# Altium schematic sheet KeeWatch_Top_Level.SchDoc
size Letter
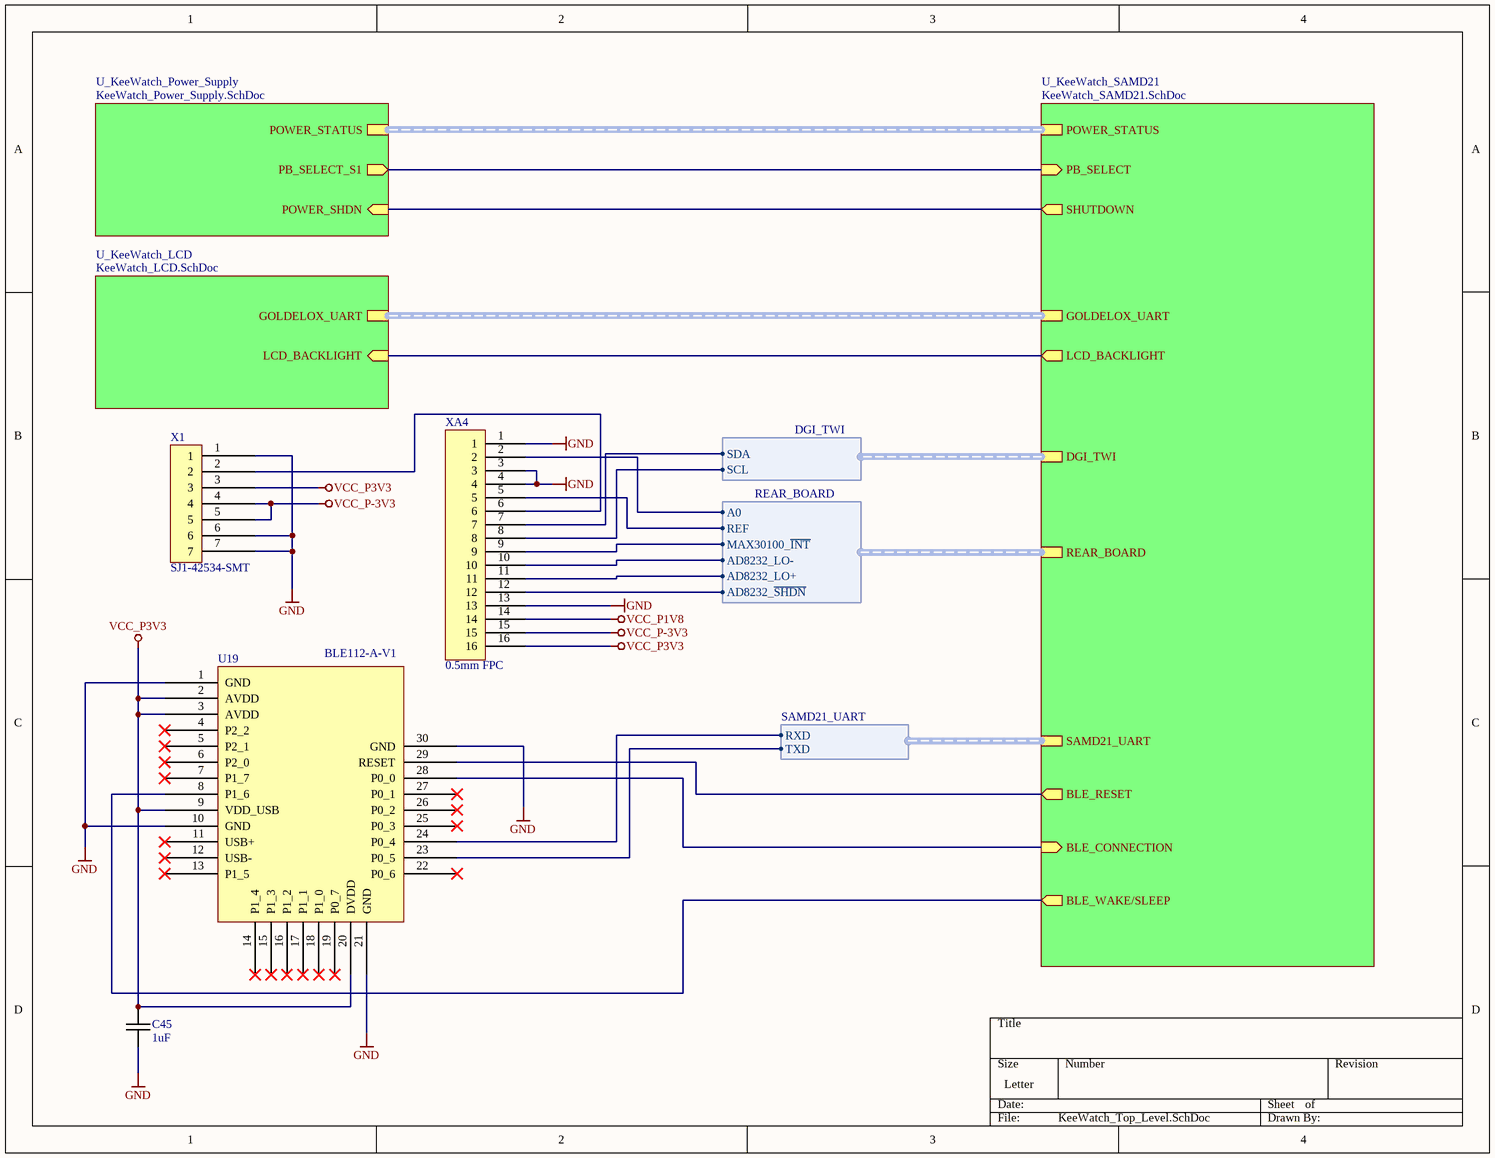
[diagram p0: KeeWatch_Top_Level.SchDoc]

## Parts
C45  1uF  [0603-Cap]
U19  BLE112-A-V1  [BLE112-A-V1]
X1  SJ1-42534-SMT  [AUDIO_JACK]
XA4  0.5mm FPC  [16-PIN CONNECTOR]

## Sub-sheets
U_KeeWatch_LCD = KeeWatch_LCD.SchDoc: LCD_BACKLIGHT (in), GOLDELOX_UART (harness GOLDELOX_UART)
U_KeeWatch_Power_Supply = KeeWatch_Power_Supply.SchDoc: POWER_SHDN (in), PB_SELECT_S1 (out), POWER_STATUS (harness POWER_STATUS)
U_KeeWatch_SAMD21 = KeeWatch_SAMD21.SchDoc: SAMD21_UART (harness SAMD21_UART), DGI_TWI (harness DGI_TWI), GOLDELOX_UART (harness GOLDELOX_UART), POWER_STATUS (harness POWER_STATUS), PB_SELECT (in), SHUTDOWN (out), LCD_BACKLIGHT (out), REAR_BOARD (harness REAR_BOARD), BLE_CONNECTION (in), BLE_RESET (out), BLE_WAKE/SLEEP (out)

## Harnesses
SAMD21_UART: TXD, RXD
DGI_TWI: SDA, SCL
REAR_BOARD: MAX30100_~{INT}, AD8232_~{SHDN}, AD8232_LO+, AD8232_LO-, A0, REF

## Nets
GND: C45.2 U19.1(GND) U19.10(GND) U19.21(GND) U19.30(GND) X1.1 X1.6 X1.7 XA4.1 XA4.3 XA4.4 XA4.13
VCC_P1V8: XA4.14
VCC_P3V3: C45.1 U19.2(AVDD) U19.3(AVDD) U19.9(VDD_USB) U19.20(DVDD) X1.3 XA4.16
VCC_P-3V3: X1.4 X1.5 XA4.15
NetU19_8: U19.8(P1_6) ; sheet U_KeeWatch_SAMD21/BLE_WAKE/SLEEP
NetU19_23: U19.23(P0_5) ; sheet U_KeeWatch_SAMD21/SAMD21_UART.TXD
NetU19_24: U19.24(P0_4) ; sheet U_KeeWatch_SAMD21/SAMD21_UART.RXD
NetU19_28: U19.28(P0_0) ; sheet U_KeeWatch_SAMD21/BLE_CONNECTION
NetU19_29: U19.29(RESET) ; sheet U_KeeWatch_SAMD21/BLE_RESET
NetX1_2: X1.2 XA4.6
NetXA4_2: XA4.2 ; sheet U_KeeWatch_SAMD21/REAR_BOARD.A0
NetXA4_5: XA4.5 ; sheet U_KeeWatch_SAMD21/REAR_BOARD.REF
NetXA4_7: XA4.7 ; sheet U_KeeWatch_SAMD21/DGI_TWI.SDA
NetXA4_8: XA4.8 ; sheet U_KeeWatch_SAMD21/DGI_TWI.SCL
NetXA4_9: XA4.9 ; sheet U_KeeWatch_SAMD21/REAR_BOARD.MAX30100_~{INT}
NetXA4_10: XA4.10 ; sheet U_KeeWatch_SAMD21/REAR_BOARD.AD8232_LO-
NetXA4_11: XA4.11 ; sheet U_KeeWatch_SAMD21/REAR_BOARD.AD8232_LO+
NetXA4_12: XA4.12 ; sheet U_KeeWatch_SAMD21/REAR_BOARD.AD8232_~{SHDN}
(unnamed): sheet U_KeeWatch_Power_Supply/POWER_SHDN, sheet U_KeeWatch_SAMD21/SHUTDOWN
(unnamed): sheet U_KeeWatch_Power_Supply/PB_SELECT_S1, sheet U_KeeWatch_SAMD21/PB_SELECT
(unnamed): sheet U_KeeWatch_SAMD21/LCD_BACKLIGHT, sheet U_KeeWatch_LCD/LCD_BACKLIGHT

Not connected (* = marked no-connect by the designer): U19 4(P2_2)* 5(P2_1)* 6(P2_0)* 7(P1_7)* 11(USB+)* 12(USB-)* 13(P1_5)* 14(P1_4)* 15(P1_3)* 16(P1_2)* 17(P1_1)* 18(P1_0)* 19(P0_7)* 22(P0_6)* 25(P0_3)* 26(P0_2)* 27(P0_1)*

## Buses and harness runs
harness sheet U_KeeWatch_LCD/GOLDELOX_UART = sheet U_KeeWatch_SAMD21/GOLDELOX_UART
harness sheet U_KeeWatch_Power_Supply/POWER_STATUS = sheet U_KeeWatch_SAMD21/POWER_STATUS

## Library data of the parts
C45 = 0603-Cap: CAPACITOR 0603 CERAMIC
X1 = SJ1-42534-SMT: 2.5 MM AUDIO JACK
XA4 = 0.5mm FPC: 0.5mm FPC 16-pin Connector